# Altium schematic sheet iso1212_inputs.schdoc
size 209 x 297 mm
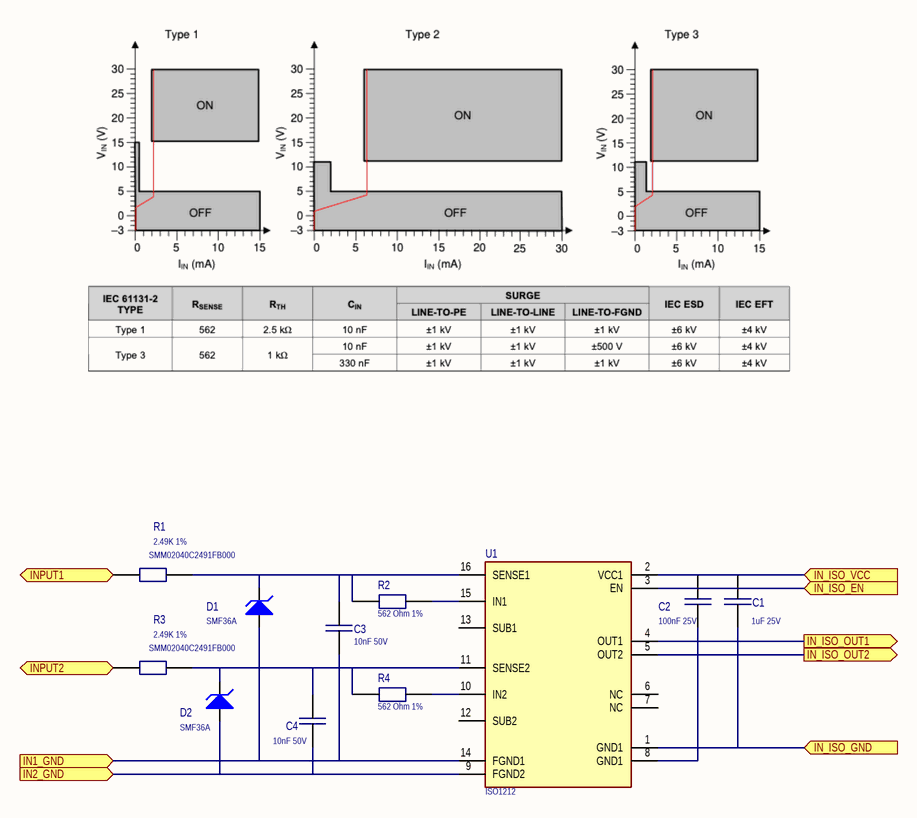
[diagram p0: iso1212_inputs.schdoc]

## Parts
C1  1uF 25V  [C_0603]
C2  100nF 25V  [C_0603]
C3  10nF 50V  [C_0603]
C4  10nF 50V  [C_0603]
D1  SMF36A  [SOD123FL]
D2  SMF36A  [SOD123FL]
R1  SMM02040C2491FB000  value 2.49K 1%  [FP-SMM0204-IPC_C]
R2  562 Ohm 1%  [R_0603]
R3  SMM02040C2491FB000  value 2.49K 1%  [FP-SMM0204-IPC_C]
R4  562 Ohm 1%  [R_0603]
U1  ISO1212  [FP-DBQ0016A-IPC_C]

## Ports
IN1_GND (in), IN2_GND (in), IN_ISO_EN (in), IN_ISO_GND (in), IN_ISO_OUT1 (out), IN_ISO_OUT2 (out), IN_ISO_VCC (in), INPUT1 (in), INPUT2 (in)

## Nets
IN1_GND: C3.2 D1.1(A) U1.14(FGND1) ; port IN1_GND
IN2_GND: C4.2 D2.1(A) U1.9(FGND2) ; port IN2_GND
IN_ISO_EN: U1.3(EN) ; port IN_ISO_EN
IN_ISO_GND: C1.1 C2.1 U1.1(GND1) U1.8(GND1) ; port IN_ISO_GND
IN_ISO_OUT1: U1.4(OUT1) ; port IN_ISO_OUT1
IN_ISO_OUT2: U1.5(OUT2) ; port IN_ISO_OUT2
IN_ISO_VCC: C1.2 C2.2 U1.2(VCC1) ; port IN_ISO_VCC
INPUT1: R1.1 ; port INPUT1
INPUT2: R3.1 ; port INPUT2
NetC3_1: C3.1 D1.2(K) R1.2 R2.1 U1.16(SENSE1)
NetC4_1: C4.1 D2.2(K) R3.2 R4.1 U1.11(SENSE2)
NetR2_2: R2.2 U1.15(IN1)
NetR4_2: R4.2 U1.10(IN2)

Not connected (* = marked no-connect by the designer): U1 6(NC) 7(NC) 12(SUB2) 13(SUB1)

## Library data of the parts
C1-C4 = C0603: Capacitor
  C1: Value: 1uF 25V
  C2: Value: 100nF 25V
  C3 C4: Value: 10nF 50V
D1 D2 = D_SOD123FL
R1 R3 = SMM0204: Resistor
R2 R4 = R0603: Resistor; Value: 562 Ohm 1%